# Altium schematic sheet deel2_....SchDoc
size A4; SheetNumber: 2; SheetTotal: 5
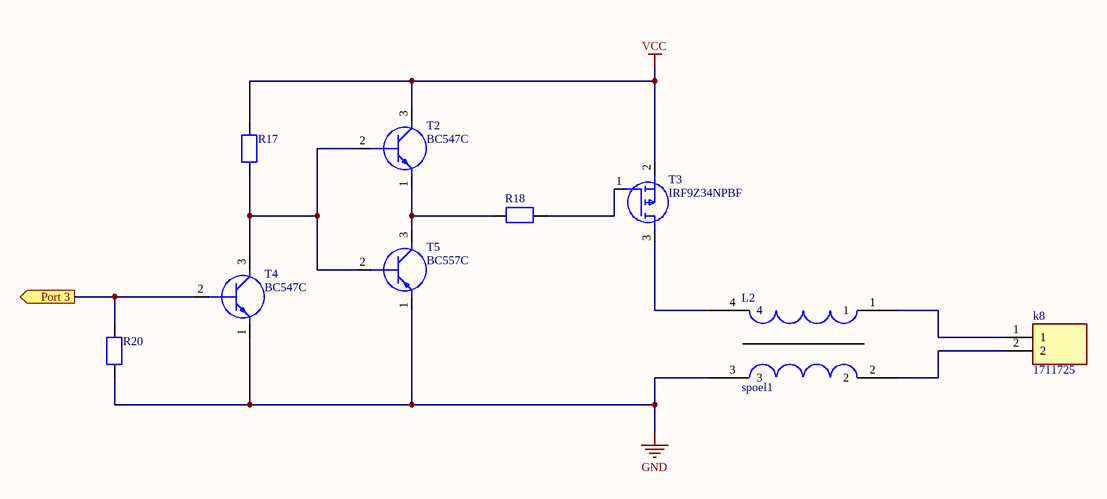
[diagram p0: deel2_....SchDoc]

## Parts
k8  1711725  [1711725]
L2  spoel1  [CM2545X171B10]
R17  CRCW08050000Z0EA  [RESC2013X50X30LL20T20]  (value not drawn)
R18  CRCW08050000Z0EA  [RESC2013X50X30LL20T20]  (value not drawn)
R20  CRCW08050000Z0EA  [RESC2013X50X30LL20T20]  (value not drawn)
T2  BC547C  [BC547C]
T3  IRF9Z34NPBF  [TO254P469X1042X1967-3P]
T4  BC547C  [BC547C]
T5  BC557C  [BC557C]

## Ports
Port 3 (out)

## Nets
GND: L2.3 R20.1 T4.1(E) T5.1(E)
VCC: R17.2 T2.3(C) T3.2(S)
Port 3: R20.2 T4.2(B) ; port Port 3
Netk8_1: k8.1 L2.1
Netk8_2: k8.2 L2.2
NetL2_4: L2.4 T3.3(D)
NetR17_1: R17.1 T2.2(B) T4.3(C) T5.2(B)
NetR18_1: R18.1 T2.1(E) T5.3(C)
NetR18_2: R18.2 T3.1(G)

## Library data of the parts
k8 = 1711725: Connector; Manufacturer_Name: Phoenix Contact; Datasheet Link: http://www.phoenixcontact.com/de/produkte/1711725/pdf; Height: 18.2mm; Manufacturer_Part_Number: 1711725; Mouser Part Number: 651-1711725; Mouser Price/Stock: https://www.mouser.co.uk/ProductDetail/Phoenix-Contact/1711725?qs=F79NelsxgYFLEb9U5DotcA%3D%3D; Arrow Part Number: 1711725; Arrow Price/Stock: https://www.arrow.com/en/products/1711725/phoenix-contact?region=nac
R17 R20 = resistor: 4k7; Manufacturer: Vishay Dale; Part Number: CRCW08050000Z0EA
R18 = resistor: 100Ohm; Manufacturer: Vishay Dale; Part Number: CRCW08050000Z0EA
T2 T4 = BC547C: Transistor BJT NPN; Manufacturer_Name: NXP; Datasheet Link: https://datasheet.octopart.com/BC547C-Philips-datasheet-120064.pdf; Height: 5.2mm; Manufacturer_Part_Number: BC547C; Mouser Part Number: 771-BC547C; Mouser Price/Stock: https://www.mouser.co.uk/ProductDetail/NXP-Semiconductors/BC547C/?qs=84A%2FDAdkstKO21mOGqKGFw%3D%3D
T3 = IRF9Z34NPBF: MOSFET (P-Channel); Manufacturer_Name: Infineon; Datasheet Link: https://www.infineon.com/dgdl/irf9z34npbf.pdf?fileId=5546d462533600a40153561220af1ddd; Height: 4.69mm; Manufacturer_Part_Number: IRF9Z34NPBF; Mouser Part Number: 942-IRF9Z34NPBF; Mouser Price/Stock: https://www.mouser.co.uk/ProductDetail/Infineon-IR/IRF9Z34NPBF?qs=9%252BKlkBgLFf16a%2FvlD%252BMCtQ%3D%3D; Arrow Part Number: IRF9Z34NPBF; Arrow Price/Stock: https://www.arrow.com/en/products/irf9z34npbf/infineon-technologies-ag?region=nac
T5 = BC557C: Transistor BJT PNP; Manufacturer_Name: NXP; Datasheet Link: http://uk.rs-online.com/web/p/products/1124775; Height: 5.2mm; Manufacturer_Part_Number: BC557C; Mouser Part Number: 771-BC557C; Mouser Price/Stock: https://www.mouser.co.uk/ProductDetail/NXP-Semiconductors/BC557C?qs=84A%2FDAdkstLO1yR4NjQrgg%3D%3D